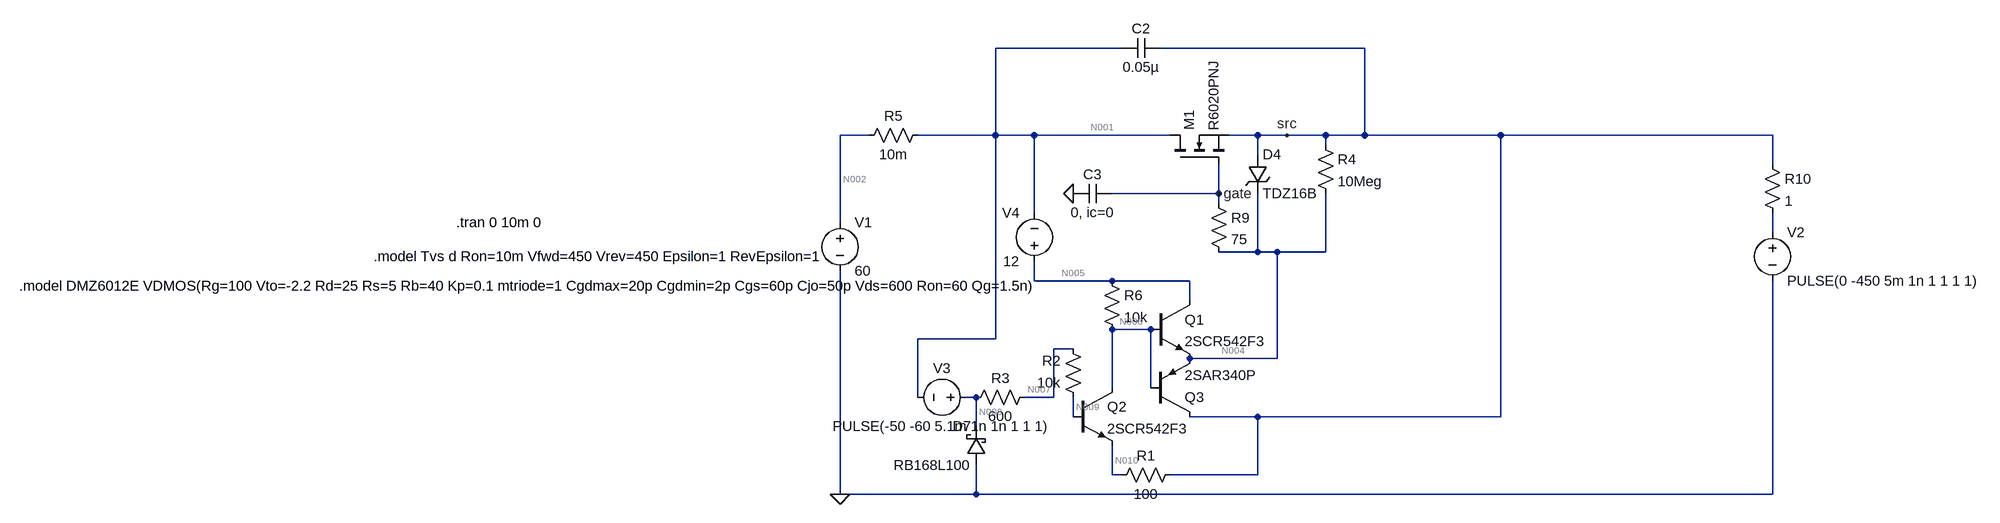
[diagram p0: schematic FET Driver rev2 bjt_test.asc]
FET Driver rev2 bjt_test.asc, the LTspice schematic file:
Version 4
SHEET 1 1884 732
WIRE 0 -112 -208 -112
WIRE 400 -112 64 -112
WIRE -416 32 -464 32
WIRE -208 32 -208 -112
WIRE -208 32 -336 32
WIRE -144 32 -208 32
WIRE 80 32 -144 32
WIRE 224 32 176 32
WIRE 272 32 224 32
WIRE 336 32 272 32
WIRE 400 32 400 -112
WIRE 400 32 336 32
WIRE 624 32 400 32
WIRE 1072 32 624 32
WIRE 336 48 336 32
WIRE 224 64 224 32
WIRE 1072 80 1072 32
WIRE 160 128 160 80
WIRE 160 128 -16 128
WIRE 160 144 160 128
WIRE -144 160 -144 32
WIRE -464 176 -464 32
WIRE 1072 192 1072 160
WIRE 224 224 224 128
WIRE 224 224 160 224
WIRE 256 224 224 224
WIRE 336 224 336 128
WIRE 336 224 256 224
WIRE -144 272 -144 240
WIRE -16 272 -144 272
WIRE 112 272 -16 272
WIRE 112 304 112 272
WIRE 48 352 -16 352
WIRE -208 368 -208 32
WIRE -208 368 -336 368
WIRE -80 384 -112 384
WIRE 256 400 256 224
WIRE 256 400 112 400
WIRE -16 448 -16 352
WIRE 48 448 48 352
WIRE -336 464 -336 368
WIRE -240 464 -256 464
WIRE -112 464 -112 384
WIRE -112 464 -160 464
WIRE -80 496 -80 464
WIRE 224 496 112 496
WIRE 624 496 624 32
WIRE 624 496 224 496
WIRE -240 512 -240 464
WIRE -16 592 -16 544
WIRE 0 592 -16 592
WIRE 224 592 224 496
WIRE 224 592 80 592
WIRE -464 624 -464 256
WIRE -240 624 -240 576
WIRE -240 624 -464 624
WIRE 1072 624 1072 272
WIRE 1072 624 -240 624
FLAG 272 32 src
FLAG 160 128 gate
FLAG -464 624 0
FLAG -80 128 0
SYMBOL nmos 80 80 R270
SYMATTR InstName M1
SYMATTR Value R6020PNJ
SYMBOL voltage -464 160 R0
WINDOW 123 0 0 Left 0
WINDOW 39 0 0 Left 0
SYMATTR InstName V1
SYMATTR Value 60
SYMBOL voltage 1072 176 R0
WINDOW 123 0 0 Left 0
WINDOW 39 0 0 Left 0
SYMATTR InstName V2
SYMATTR Value PULSE(0 -450 5m 1n 1 1 1 1)
SYMBOL zener 208 64 R0
SYMATTR InstName D4
SYMATTR Value TDZ16B
SYMATTR Description Diode
SYMATTR Type diode
SYMBOL voltage -240 464 R90
WINDOW 0 -32 56 VBottom 2
WINDOW 3 32 56 VTop 2
WINDOW 123 0 0 Left 0
WINDOW 39 0 0 Left 0
SYMATTR InstName V3
SYMATTR Value PULSE(-50 -60 5.1m 1n 1n 1 1 1)
SYMBOL res -432 48 R270
WINDOW 0 32 56 VTop 2
WINDOW 3 0 56 VBottom 2
SYMATTR InstName R5
SYMATTR Value 10m
SYMBOL res 320 32 R0
SYMATTR InstName R4
SYMATTR Value 10Meg
SYMBOL res -256 480 R270
WINDOW 0 32 56 VTop 2
WINDOW 3 0 56 VBottom 2
SYMATTR InstName R3
SYMATTR Value 600
SYMBOL cap 64 -128 R90
WINDOW 0 0 32 VBottom 2
WINDOW 3 32 32 VTop 2
SYMATTR InstName C2
SYMATTR Value 0.05µ
SYMBOL res 144 128 R0
SYMATTR InstName R9
SYMATTR Value 75
SYMBOL res 1056 64 R0
SYMATTR InstName R10
SYMATTR Value 1
SYMBOL cap -16 112 R90
WINDOW 0 0 32 VBottom 2
WINDOW 3 32 32 VTop 2
SYMATTR InstName C3
SYMATTR Value 0, ic=0
SYMBOL schottky -224 576 R180
WINDOW 0 24 64 Left 2
WINDOW 3 24 0 Left 2
SYMATTR InstName D7
SYMATTR Value RB168L100
SYMATTR Description Diode
SYMATTR Type diode
SYMBOL npn 48 304 R0
SYMATTR InstName Q1
SYMATTR Value 2SCR542F3
SYMBOL res 96 576 R90
WINDOW 0 0 56 VBottom 2
WINDOW 3 32 56 VTop 2
SYMATTR InstName R1
SYMATTR Value 100
SYMBOL pnp 48 496 M180
SYMATTR InstName Q3
SYMATTR Value 2SAR340P
SYMBOL npn -80 448 R0
SYMATTR InstName Q2
SYMATTR Value 2SCR542F3
SYMBOL res -64 480 R180
WINDOW 0 36 76 Left 2
WINDOW 3 36 40 Left 2
SYMATTR InstName R2
SYMATTR Value 10k
SYMBOL voltage -144 256 R180
WINDOW 0 24 96 Left 2
WINDOW 3 24 16 Left 2
WINDOW 123 0 0 Left 0
WINDOW 39 0 0 Left 0
SYMATTR InstName V4
SYMATTR Value 12
SYMBOL res -32 256 R0
SYMATTR InstName R6
SYMATTR Value 10k
TEXT -1096 176 Left 2 !.tran 0 10m 0
TEXT -1232 232 Left 2 !.model Tvs d Ron=10m Vfwd=450 Vrev=450 Epsilon=1 RevEpsilon=1
TEXT -1816 280 Left 2 !.model DMZ6012E VDMOS(Rg=100 Vto=-2.2 Rd=25 Rs=5 Rb=40 Kp=0.1 mtriode=1 Cgdmax=20p Cgdmin=2p Cgs=60p Cjo=50p Vds=600 Ron=60 Qg=1.5n)

The netlist it stands for:
* FET Driver rev2 bjt_test.asc
M1 N001 gate src src R6020PNJ
V1 N002 0 60
V2 N003 0 PULSE(0 -450 5m 1n 1 1 1 1)
D4 src N004 TDZ16B
V3 N008 N001 PULSE(-50 -60 5.1m 1n 1n 1 1 1)
R5 N002 N001 10m
R4 src N004 10Meg
R3 N008 N007 600
C2 src N001 0.05µ
R9 gate N004 75
R10 src N003 1
C3 gate 0 0, ic=0
D7 0 N008 RB168L100
Q1 N005 N006 N004 0 2SCR542F3
R1 src N010 100
Q3 src N006 N004 0 2SAR340P
Q2 N006 N009 N010 0 2SCR542F3
R2 N009 N007 10k
V4 N005 N001 12
R6 N005 N006 10k
.model D D
.lib standard.dio
.model NPN NPN
.model PNP PNP
.lib standard.bjt
.model NMOS NMOS
.model PMOS PMOS
.lib standard.mos
.tran 0 10m 0
.model Tvs d Ron=10m Vfwd=450 Vrev=450 Epsilon=1 RevEpsilon=1
.model DMZ6012E VDMOS(Rg=100 Vto=-2.2 Rd=25 Rs=5 Rb=40 Kp=0.1 mtriode=1 Cgdmax=20p Cgdmin=2p Cgs=60p Cjo=50p Vds=600 Ron=60 Qg=1.5n)
.backanno
.end

* Results of the author's LTspice run, read from the files saved beside the schematic
* Operating Point, zero values left out:
*   V(n001) = 60 V
*   V(gate) = 3.215 µV
*   V(src) = 7.92 mV
*   V(n002) = 60 V
*   V(n004) = 241.1 mV
*   V(n008) = 10 V
*   V(n007) = 9.516 V
*   V(n005) = 72 V
*   V(n006) = 804.3 mV
*   V(n010) = 799.9 mV
*   V(n009) = 1.453 V
*   Ic(Q3) = -1.664 pA
*   Ib(Q3) = 2.479 pA
*   Ic(Q2) = 7.113 mA
*   Ib(Q2) = 806.3 µA
*   Ie(Q2) = -7.92 mA
*   Ic(Q1) = 3.209 mA
*   Ib(Q1) = 6.099 µA
*   Ie(Q1) = -3.215 mA
*   Id(M1) = 640.9 pA
*   Is(M1) = -640.9 pA
*   I(C3) = 3.215 mA
*   I(D7) = -21.72 nA
*   I(D4) = -45.34 pA
*   I(R6) = 7.12 mA
*   I(R2) = -806.3 µA
*   I(R1) = -7.92 mA
*   I(R10) = 7.92 mA
*   I(R9) = -3.215 mA
*   I(R3) = 806.3 µA
*   I(R4) = -23.32 nA
*   I(R5) = 11.14 mA
*   I(V4) = -10.33 mA
*   I(V3) = -806.3 µA
*   I(V2) = 7.92 mA
*   I(V1) = -11.14 mA
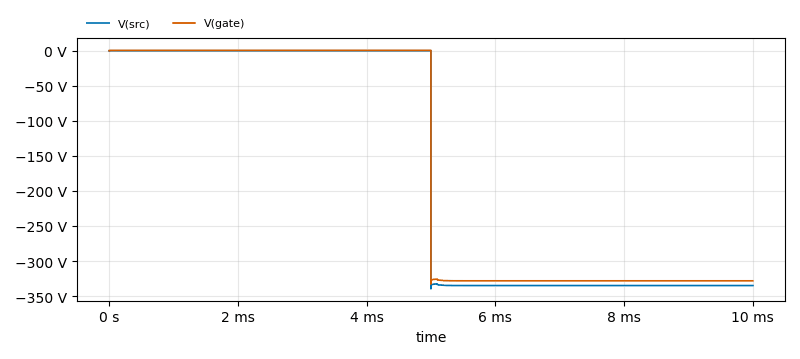
[diagram p1: Transient Analysis of FET Driver rev2 bjt_test.asc, plotted from the saved traces]
* Transient Analysis, 1 run:
*   V(src): min -339.6 V, max 9.659 mV, average -167.4 V, rms 236.8 V, last -334.9 V
*   V(gate): min -332.9 V, max 526.9 mV, average -163.8 V, rms 232 V, last -328.2 V